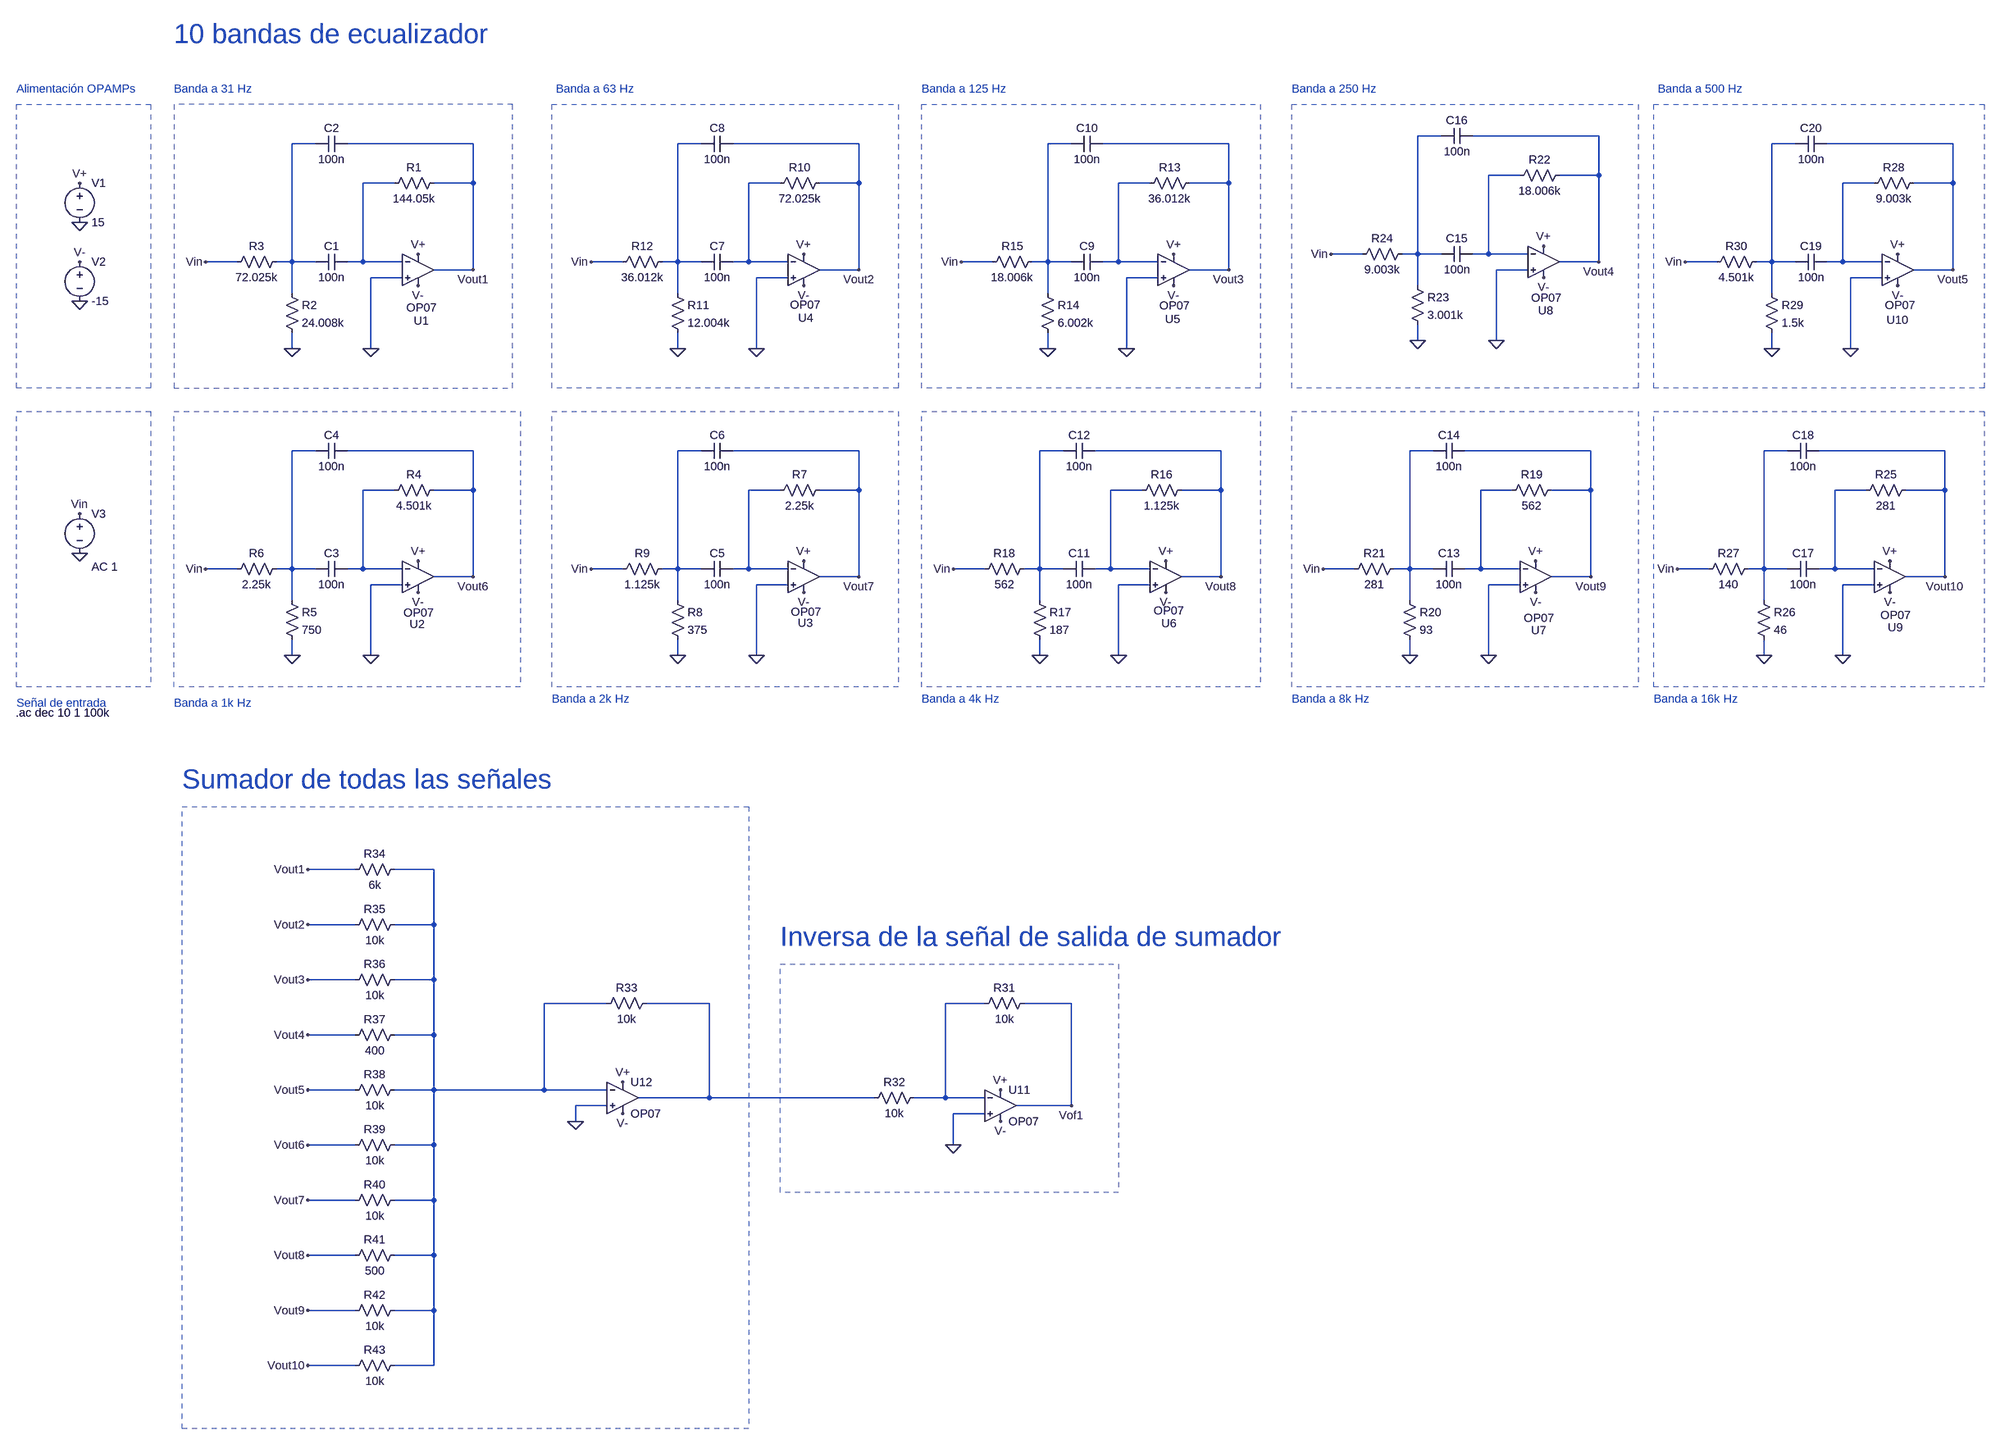
[diagram p0: schematic Ecualizador de 10 bandas.asc]
Ecualizador de 10 bandas.asc, the LTspice schematic file:
Version 4
SHEET 1 3644 2564
WIRE 2448 -112 2400 -112
WIRE 2768 -112 2512 -112
WIRE 160 -96 112 -96
WIRE 480 -96 224 -96
WIRE 944 -96 896 -96
WIRE 1264 -96 1008 -96
WIRE 1696 -96 1648 -96
WIRE 2016 -96 1760 -96
WIRE 3168 -96 3120 -96
WIRE 3488 -96 3232 -96
WIRE 2608 -32 2544 -32
WIRE 2768 -32 2768 -112
WIRE 2768 -32 2688 -32
WIRE 320 -16 256 -16
WIRE 480 -16 480 -96
WIRE 480 -16 400 -16
WIRE 1104 -16 1040 -16
WIRE 1264 -16 1264 -96
WIRE 1264 -16 1184 -16
WIRE 1856 -16 1792 -16
WIRE 2016 -16 2016 -96
WIRE 2016 -16 1936 -16
WIRE 3328 -16 3264 -16
WIRE 3488 -16 3488 -96
WIRE 3488 -16 3408 -16
WIRE 2288 128 2224 128
WIRE 2400 128 2400 -112
WIRE 2400 128 2368 128
WIRE 2448 128 2400 128
WIRE 2544 128 2544 -32
WIRE 2544 128 2512 128
WIRE 2624 128 2544 128
WIRE 0 144 -64 144
WIRE 112 144 112 -96
WIRE 112 144 80 144
WIRE 160 144 112 144
WIRE 256 144 256 -16
WIRE 256 144 224 144
WIRE 336 144 256 144
WIRE 784 144 720 144
WIRE 896 144 896 -96
WIRE 896 144 864 144
WIRE 944 144 896 144
WIRE 1040 144 1040 -16
WIRE 1040 144 1008 144
WIRE 1120 144 1040 144
WIRE 1536 144 1472 144
WIRE 1648 144 1648 -96
WIRE 1648 144 1616 144
WIRE 1696 144 1648 144
WIRE 1792 144 1792 -16
WIRE 1792 144 1760 144
WIRE 1872 144 1792 144
WIRE 2768 144 2768 -32
WIRE 2768 144 2688 144
WIRE 3008 144 2944 144
WIRE 3120 144 3120 -96
WIRE 3120 144 3088 144
WIRE 3168 144 3120 144
WIRE 3264 144 3264 -16
WIRE 3264 144 3232 144
WIRE 3344 144 3264 144
WIRE 480 160 480 -16
WIRE 480 160 400 160
WIRE 1264 160 1264 -16
WIRE 1264 160 1184 160
WIRE 2016 160 2016 -16
WIRE 2016 160 1936 160
WIRE 2624 160 2560 160
WIRE 3488 160 3488 -16
WIRE 3488 160 3408 160
WIRE 336 176 272 176
WIRE 1120 176 1056 176
WIRE 1872 176 1808 176
WIRE 3344 176 3280 176
WIRE 2400 192 2400 128
WIRE 112 208 112 144
WIRE 896 208 896 144
WIRE 1648 208 1648 144
WIRE 3120 208 3120 144
WIRE 2400 304 2400 272
WIRE 2560 304 2560 160
WIRE 112 320 112 288
WIRE 272 320 272 176
WIRE 896 320 896 288
WIRE 1056 320 1056 176
WIRE 1648 320 1648 288
WIRE 1808 320 1808 176
WIRE 3120 320 3120 288
WIRE 3280 320 3280 176
WIRE 160 528 112 528
WIRE 480 528 224 528
WIRE 944 528 896 528
WIRE 1264 528 1008 528
WIRE 1680 528 1632 528
WIRE 2000 528 1744 528
WIRE 2432 528 2384 528
WIRE 2752 528 2496 528
WIRE 3152 528 3104 528
WIRE 3472 528 3216 528
WIRE 320 608 256 608
WIRE 480 608 480 528
WIRE 480 608 400 608
WIRE 1104 608 1040 608
WIRE 1264 608 1264 528
WIRE 1264 608 1184 608
WIRE 1840 608 1776 608
WIRE 2000 608 2000 528
WIRE 2000 608 1920 608
WIRE 2592 608 2528 608
WIRE 2752 608 2752 528
WIRE 2752 608 2672 608
WIRE 3312 608 3248 608
WIRE 3472 608 3472 528
WIRE 3472 608 3392 608
WIRE 0 768 -64 768
WIRE 112 768 112 528
WIRE 112 768 80 768
WIRE 160 768 112 768
WIRE 256 768 256 608
WIRE 256 768 224 768
WIRE 336 768 256 768
WIRE 784 768 720 768
WIRE 896 768 896 528
WIRE 896 768 864 768
WIRE 944 768 896 768
WIRE 1040 768 1040 608
WIRE 1040 768 1008 768
WIRE 1120 768 1040 768
WIRE 1520 768 1456 768
WIRE 1632 768 1632 528
WIRE 1632 768 1600 768
WIRE 1680 768 1632 768
WIRE 1776 768 1776 608
WIRE 1776 768 1744 768
WIRE 1856 768 1776 768
WIRE 2272 768 2208 768
WIRE 2384 768 2384 528
WIRE 2384 768 2352 768
WIRE 2432 768 2384 768
WIRE 2528 768 2528 608
WIRE 2528 768 2496 768
WIRE 2608 768 2528 768
WIRE 2992 768 2928 768
WIRE 3104 768 3104 528
WIRE 3104 768 3072 768
WIRE 3152 768 3104 768
WIRE 3248 768 3248 608
WIRE 3248 768 3216 768
WIRE 3328 768 3248 768
WIRE 480 784 480 608
WIRE 480 784 400 784
WIRE 1264 784 1264 608
WIRE 1264 784 1184 784
WIRE 2000 784 2000 608
WIRE 2000 784 1920 784
WIRE 2752 784 2752 608
WIRE 2752 784 2672 784
WIRE 3472 784 3472 608
WIRE 3472 784 3392 784
WIRE 336 800 272 800
WIRE 1120 800 1056 800
WIRE 1856 800 1792 800
WIRE 2608 800 2544 800
WIRE 3328 800 3264 800
WIRE 112 832 112 768
WIRE 896 832 896 768
WIRE 1632 832 1632 768
WIRE 2384 832 2384 768
WIRE 3104 832 3104 768
WIRE 112 944 112 912
WIRE 272 944 272 800
WIRE 896 944 896 912
WIRE 1056 944 1056 800
WIRE 1632 944 1632 912
WIRE 1792 944 1792 800
WIRE 2384 944 2384 912
WIRE 2544 944 2544 800
WIRE 3104 944 3104 912
WIRE 3264 944 3264 800
WIRE 240 1424 144 1424
WIRE 400 1424 320 1424
WIRE 240 1536 144 1536
WIRE 400 1536 400 1424
WIRE 400 1536 320 1536
WIRE 240 1648 144 1648
WIRE 400 1648 400 1536
WIRE 400 1648 320 1648
WIRE 752 1696 624 1696
WIRE 960 1696 832 1696
WIRE 1520 1696 1440 1696
WIRE 1696 1696 1600 1696
WIRE 240 1760 144 1760
WIRE 400 1760 400 1648
WIRE 400 1760 320 1760
WIRE 240 1872 144 1872
WIRE 400 1872 400 1760
WIRE 400 1872 320 1872
WIRE 624 1872 624 1696
WIRE 624 1872 400 1872
WIRE 752 1872 624 1872
WIRE 960 1888 960 1696
WIRE 960 1888 816 1888
WIRE 1296 1888 960 1888
WIRE 1440 1888 1440 1696
WIRE 1440 1888 1376 1888
WIRE 1520 1888 1440 1888
WIRE 752 1904 688 1904
WIRE 1696 1904 1696 1696
WIRE 1696 1904 1584 1904
WIRE 1520 1920 1456 1920
WIRE 688 1936 688 1904
WIRE 240 1984 144 1984
WIRE 400 1984 400 1872
WIRE 400 1984 320 1984
WIRE 1456 1984 1456 1920
WIRE 240 2096 144 2096
WIRE 400 2096 400 1984
WIRE 400 2096 320 2096
WIRE 240 2208 144 2208
WIRE 400 2208 400 2096
WIRE 400 2208 320 2208
WIRE 240 2320 144 2320
WIRE 400 2320 400 2208
WIRE 400 2320 320 2320
WIRE 240 2432 144 2432
WIRE 400 2432 400 2320
WIRE 400 2432 320 2432
FLAG -320 224 0
FLAG -320 64 0
FLAG -320 -16 V+
FLAG -320 144 V-
FLAG 368 128 V+
FLAG 368 192 V-
FLAG 112 320 0
FLAG 272 320 0
FLAG 368 752 V+
FLAG 368 816 V-
FLAG 112 944 0
FLAG 272 944 0
FLAG 1152 752 V+
FLAG 1152 816 V-
FLAG 896 944 0
FLAG 1056 944 0
FLAG 1152 128 V+
FLAG 1152 192 V-
FLAG 896 320 0
FLAG 1056 320 0
FLAG 1904 128 V+
FLAG 1904 192 V-
FLAG 1648 320 0
FLAG 1808 320 0
FLAG 1888 752 V+
FLAG 1888 816 V-
FLAG 1632 944 0
FLAG 1792 944 0
FLAG 2640 752 V+
FLAG 2640 816 V-
FLAG 2384 944 0
FLAG 2544 944 0
FLAG 2656 112 V+
FLAG 2656 176 V-
FLAG 2400 304 0
FLAG 2560 304 0
FLAG 3360 752 V+
FLAG 3360 816 V-
FLAG 3104 944 0
FLAG 3264 944 0
FLAG 3376 128 V+
FLAG 3376 192 V-
FLAG 3120 320 0
FLAG 3280 320 0
FLAG -320 656 Vin
FLAG -320 736 0
FLAG -64 144 Vin
FLAG 720 144 Vin
FLAG 1472 144 Vin
FLAG 2224 128 Vin
FLAG 2944 144 Vin
FLAG -64 768 Vin
FLAG 720 768 Vin
FLAG 1456 768 Vin
FLAG 2208 768 Vin
FLAG 2928 768 Vin
FLAG 480 160 Vout1
FLAG 1264 160 Vout2
FLAG 2016 160 Vout3
FLAG 2768 144 Vout4
FLAG 3488 160 Vout5
FLAG 3472 784 Vout10
FLAG 2752 784 Vout9
FLAG 2000 784 Vout8
FLAG 1264 784 Vout7
FLAG 480 784 Vout6
FLAG 1456 1984 0
FLAG 1552 1872 V+
FLAG 1552 1936 V-
FLAG 1696 1904 Vof1
FLAG 784 1856 V+
FLAG 784 1920 V-
FLAG 688 1936 0
FLAG 144 1424 Vout1
FLAG 144 1536 Vout2
FLAG 144 1648 Vout3
FLAG 144 1760 Vout4
FLAG 144 1872 Vout5
FLAG 144 1984 Vout6
FLAG 144 2096 Vout7
FLAG 144 2208 Vout8
FLAG 144 2320 Vout9
FLAG 144 2432 Vout10
SYMBOL OpAmps\\OP07 368 96 R0
WINDOW 0 -9 168 Left 2
WINDOW 3 -24 141 Left 2
SYMATTR InstName U1
SYMBOL voltage -320 -32 R0
WINDOW 123 0 0 Left 0
WINDOW 39 0 0 Left 0
SYMATTR InstName V1
SYMATTR Value 15
SYMBOL voltage -320 128 R0
WINDOW 123 0 0 Left 0
WINDOW 39 0 0 Left 0
SYMATTR InstName V2
SYMATTR Value -15
SYMBOL res 416 -32 R90
WINDOW 0 0 56 VBottom 2
WINDOW 3 32 56 VTop 2
SYMATTR InstName R1
SYMATTR Value 144.05k
SYMBOL res 96 192 R0
SYMATTR InstName R2
SYMATTR Value 24.008k
SYMBOL res 96 128 R90
WINDOW 0 0 56 VBottom 2
WINDOW 3 32 56 VTop 2
SYMATTR InstName R3
SYMATTR Value 72.025k
SYMBOL cap 224 128 R90
WINDOW 0 0 32 VBottom 2
WINDOW 3 32 32 VTop 2
SYMATTR InstName C1
SYMATTR Value 100n
SYMBOL cap 224 -112 R90
WINDOW 0 0 32 VBottom 2
WINDOW 3 32 32 VTop 2
SYMATTR InstName C2
SYMATTR Value 100n
SYMBOL OpAmps\\OP07 368 720 R0
WINDOW 0 -17 160 Left 2
WINDOW 3 -30 137 Left 2
SYMATTR InstName U2
SYMBOL res 416 592 R90
WINDOW 0 0 56 VBottom 2
WINDOW 3 32 56 VTop 2
SYMATTR InstName R4
SYMATTR Value 4.501k
SYMBOL res 96 816 R0
SYMATTR InstName R5
SYMATTR Value 750
SYMBOL res 96 752 R90
WINDOW 0 0 56 VBottom 2
WINDOW 3 32 56 VTop 2
SYMATTR InstName R6
SYMATTR Value 2.25k
SYMBOL cap 224 752 R90
WINDOW 0 0 32 VBottom 2
WINDOW 3 32 32 VTop 2
SYMATTR InstName C3
SYMATTR Value 100n
SYMBOL cap 224 512 R90
WINDOW 0 0 32 VBottom 2
WINDOW 3 32 32 VTop 2
SYMATTR InstName C4
SYMATTR Value 100n
SYMBOL OpAmps\\OP07 1152 720 R0
WINDOW 0 -12 158 Left 2
WINDOW 3 -26 135 Left 2
SYMATTR InstName U3
SYMBOL res 1200 592 R90
WINDOW 0 0 56 VBottom 2
WINDOW 3 32 56 VTop 2
SYMATTR InstName R7
SYMATTR Value 2.25k
SYMBOL res 880 816 R0
SYMATTR InstName R8
SYMATTR Value 375
SYMBOL res 880 752 R90
WINDOW 0 0 56 VBottom 2
WINDOW 3 32 56 VTop 2
SYMATTR InstName R9
SYMATTR Value 1.125k
SYMBOL cap 1008 752 R90
WINDOW 0 0 32 VBottom 2
WINDOW 3 32 32 VTop 2
SYMATTR InstName C5
SYMATTR Value 100n
SYMBOL cap 1008 512 R90
WINDOW 0 0 32 VBottom 2
WINDOW 3 32 32 VTop 2
SYMATTR InstName C6
SYMATTR Value 100n
SYMBOL OpAmps\\OP07 1152 96 R0
WINDOW 0 -11 162 Left 2
WINDOW 3 -28 135 Left 2
SYMATTR InstName U4
SYMBOL res 1200 -32 R90
WINDOW 0 0 56 VBottom 2
WINDOW 3 32 56 VTop 2
SYMATTR InstName R10
SYMATTR Value 72.025k
SYMBOL res 880 192 R0
SYMATTR InstName R11
SYMATTR Value 12.004k
SYMBOL res 880 128 R90
WINDOW 0 0 56 VBottom 2
WINDOW 3 32 56 VTop 2
SYMATTR InstName R12
SYMATTR Value 36.012k
SYMBOL cap 1008 128 R90
WINDOW 0 0 32 VBottom 2
WINDOW 3 32 32 VTop 2
SYMATTR InstName C7
SYMATTR Value 100n
SYMBOL cap 1008 -112 R90
WINDOW 0 0 32 VBottom 2
WINDOW 3 32 32 VTop 2
SYMATTR InstName C8
SYMATTR Value 100n
SYMBOL OpAmps\\OP07 1904 96 R0
WINDOW 0 -17 164 Left 2
WINDOW 3 -29 137 Left 2
SYMATTR InstName U5
SYMBOL res 1952 -32 R90
WINDOW 0 0 56 VBottom 2
WINDOW 3 32 56 VTop 2
SYMATTR InstName R13
SYMATTR Value 36.012k
SYMBOL res 1632 192 R0
SYMATTR InstName R14
SYMATTR Value 6.002k
SYMBOL res 1632 128 R90
WINDOW 0 0 56 VBottom 2
WINDOW 3 32 56 VTop 2
SYMATTR InstName R15
SYMATTR Value 18.006k
SYMBOL cap 1760 128 R90
WINDOW 0 0 32 VBottom 2
WINDOW 3 32 32 VTop 2
SYMATTR InstName C9
SYMATTR Value 100n
SYMBOL cap 1760 -112 R90
WINDOW 0 0 32 VBottom 2
WINDOW 3 32 32 VTop 2
SYMATTR InstName C10
SYMATTR Value 100n
SYMBOL OpAmps\\OP07 1888 720 R0
WINDOW 0 -9 159 Left 2
WINDOW 3 -25 133 Left 2
SYMATTR InstName U6
SYMBOL res 1936 592 R90
WINDOW 0 0 56 VBottom 2
WINDOW 3 32 56 VTop 2
SYMATTR InstName R16
SYMATTR Value 1.125k
SYMBOL res 1616 816 R0
SYMATTR InstName R17
SYMATTR Value 187
SYMBOL res 1616 752 R90
WINDOW 0 0 56 VBottom 2
WINDOW 3 32 56 VTop 2
SYMATTR InstName R18
SYMATTR Value 562
SYMBOL cap 1744 752 R90
WINDOW 0 0 32 VBottom 2
WINDOW 3 32 32 VTop 2
SYMATTR InstName C11
SYMATTR Value 100n
SYMBOL cap 1744 512 R90
WINDOW 0 0 32 VBottom 2
WINDOW 3 32 32 VTop 2
SYMATTR InstName C12
SYMATTR Value 100n
SYMBOL OpAmps\\OP07 2640 720 R0
WINDOW 0 -9 173 Left 2
WINDOW 3 -24 148 Left 2
SYMATTR InstName U7
SYMBOL res 2688 592 R90
WINDOW 0 0 56 VBottom 2
WINDOW 3 32 56 VTop 2
SYMATTR InstName R19
SYMATTR Value 562
SYMBOL res 2368 816 R0
SYMATTR InstName R20
SYMATTR Value 93
SYMBOL res 2368 752 R90
WINDOW 0 0 56 VBottom 2
WINDOW 3 32 56 VTop 2
SYMATTR InstName R21
SYMATTR Value 281
SYMBOL cap 2496 752 R90
WINDOW 0 0 32 VBottom 2
WINDOW 3 32 32 VTop 2
SYMATTR InstName C13
SYMATTR Value 100n
SYMBOL cap 2496 512 R90
WINDOW 0 0 32 VBottom 2
WINDOW 3 32 32 VTop 2
SYMATTR InstName C14
SYMATTR Value 100n
SYMBOL OpAmps\\OP07 2656 80 R0
WINDOW 0 -11 163 Left 2
WINDOW 3 -25 137 Left 2
SYMATTR InstName U8
SYMBOL res 2704 -48 R90
WINDOW 0 0 56 VBottom 2
WINDOW 3 32 56 VTop 2
SYMATTR InstName R22
SYMATTR Value 18.006k
SYMBOL res 2384 176 R0
SYMATTR InstName R23
SYMATTR Value 3.001k
SYMBOL res 2384 112 R90
WINDOW 0 0 56 VBottom 2
WINDOW 3 32 56 VTop 2
SYMATTR InstName R24
SYMATTR Value 9.003k
SYMBOL cap 2512 112 R90
WINDOW 0 0 32 VBottom 2
WINDOW 3 32 32 VTop 2
SYMATTR InstName C15
SYMATTR Value 100n
SYMBOL cap 2512 -128 R90
WINDOW 0 0 32 VBottom 2
WINDOW 3 32 32 VTop 2
SYMATTR InstName C16
SYMATTR Value 100n
SYMBOL OpAmps\\OP07 3360 720 R0
WINDOW 0 -4 167 Left 2
WINDOW 3 -19 142 Left 2
SYMATTR InstName U9
SYMBOL res 3408 592 R90
WINDOW 0 0 56 VBottom 2
WINDOW 3 32 56 VTop 2
SYMATTR InstName R25
SYMATTR Value 281
SYMBOL res 3088 816 R0
SYMATTR InstName R26
SYMATTR Value 46
SYMBOL res 3088 752 R90
WINDOW 0 0 56 VBottom 2
WINDOW 3 32 56 VTop 2
SYMATTR InstName R27
SYMATTR Value 140
SYMBOL cap 3216 752 R90
WINDOW 0 0 32 VBottom 2
WINDOW 3 32 32 VTop 2
SYMATTR InstName C17
SYMATTR Value 100n
SYMBOL cap 3216 512 R90
WINDOW 0 0 32 VBottom 2
WINDOW 3 32 32 VTop 2
SYMATTR InstName C18
SYMATTR Value 100n
SYMBOL OpAmps\\OP07 3376 96 R0
WINDOW 0 -23 166 Left 2
WINDOW 3 -26 136 Left 2
SYMATTR InstName U10
SYMBOL res 3424 -32 R90
WINDOW 0 0 56 VBottom 2
WINDOW 3 32 56 VTop 2
SYMATTR InstName R28
SYMATTR Value 9.003k
SYMBOL res 3104 192 R0
SYMATTR InstName R29
SYMATTR Value 1.5k
SYMBOL res 3104 128 R90
WINDOW 0 0 56 VBottom 2
WINDOW 3 32 56 VTop 2
SYMATTR InstName R30
SYMATTR Value 4.501k
SYMBOL cap 3232 128 R90
WINDOW 0 0 32 VBottom 2
WINDOW 3 32 32 VTop 2
SYMATTR InstName C19
SYMATTR Value 100n
SYMBOL cap 3232 -112 R90
WINDOW 0 0 32 VBottom 2
WINDOW 3 32 32 VTop 2
SYMATTR InstName C20
SYMATTR Value 100n
SYMBOL voltage -320 640 R0
WINDOW 123 24 124 Left 2
WINDOW 39 0 0 Left 0
SYMATTR InstName V3
SYMATTR Value ""
SYMATTR Value2 AC 1
SYMBOL OpAmps\\OP07 1552 1840 R0
SYMATTR InstName U11
SYMBOL res 1616 1680 R90
WINDOW 0 0 56 VBottom 2
WINDOW 3 32 56 VTop 2
SYMATTR InstName R31
SYMATTR Value 10k
SYMBOL res 1392 1872 R90
WINDOW 0 0 56 VBottom 2
WINDOW 3 32 56 VTop 2
SYMATTR InstName R32
SYMATTR Value 10k
SYMBOL OpAmps\\OP07 784 1824 R0
SYMATTR InstName U12
SYMBOL res 848 1680 R90
WINDOW 0 0 56 VBottom 2
WINDOW 3 32 56 VTop 2
SYMATTR InstName R33
SYMATTR Value 10k
SYMBOL res 336 1408 R90
WINDOW 0 0 56 VBottom 2
WINDOW 3 32 56 VTop 2
SYMATTR InstName R34
SYMATTR Value 6k
SYMBOL res 336 1520 R90
WINDOW 0 0 56 VBottom 2
WINDOW 3 32 56 VTop 2
SYMATTR InstName R35
SYMATTR Value 10k
SYMBOL res 336 1632 R90
WINDOW 0 0 56 VBottom 2
WINDOW 3 32 56 VTop 2
SYMATTR InstName R36
SYMATTR Value 10k
SYMBOL res 336 1744 R90
WINDOW 0 0 56 VBottom 2
WINDOW 3 32 56 VTop 2
SYMATTR InstName R37
SYMATTR Value 400
SYMBOL res 336 1856 R90
WINDOW 0 0 56 VBottom 2
WINDOW 3 32 56 VTop 2
SYMATTR InstName R38
SYMATTR Value 10k
SYMBOL res 336 1968 R90
WINDOW 0 0 56 VBottom 2
WINDOW 3 32 56 VTop 2
SYMATTR InstName R39
SYMATTR Value 10k
SYMBOL res 336 2080 R90
WINDOW 0 0 56 VBottom 2
WINDOW 3 32 56 VTop 2
SYMATTR InstName R40
SYMATTR Value 10k
SYMBOL res 336 2192 R90
WINDOW 0 0 56 VBottom 2
WINDOW 3 32 56 VTop 2
SYMATTR InstName R41
SYMATTR Value 500
SYMBOL res 336 2304 R90
WINDOW 0 0 56 VBottom 2
WINDOW 3 32 56 VTop 2
SYMATTR InstName R42
SYMATTR Value 10k
SYMBOL res 336 2416 R90
WINDOW 0 0 56 VBottom 2
WINDOW 3 32 56 VTop 2
SYMATTR InstName R43
SYMATTR Value 10k
TEXT -128 -208 Left 2 ;Banda a 31 Hz
TEXT 648 -208 Left 2 ;Banda a 63 Hz
TEXT 1392 -208 Left 2 ;Banda a 125 Hz
TEXT 2144 -208 Left 2 ;Banda a 250 Hz
TEXT 2888 -208 Left 2 ;Banda a 500 Hz
TEXT -128 1040 Left 2 ;Banda a 1k Hz
TEXT 640 1032 Left 2 ;Banda a 2k Hz
TEXT 1392 1032 Left 2 ;Banda a 4k Hz
TEXT 2144 1032 Left 2 ;Banda a 8k Hz
TEXT 2880 1032 Left 2 ;Banda a 16k Hz
TEXT -448 -208 Left 2 ;Alimentación OPAMPs
TEXT -448 1040 Left 2 ;Señal de entrada
TEXT -450 1060 Left 2 !.ac dec 10 1 100k
TEXT -128 -320 Left 5 ;10 bandas de ecualizador
TEXT 1104 1560 Left 5 ;Inversa de la señal de salida de sumador
TEXT -112 1240 Left 5 ;Sumador de todas las señales
LINE Normal 560 -176 -128 -176 2
LINE Normal 560 400 560 -176 2
LINE Normal -128 400 560 400 2
LINE Normal -128 -176 -128 400 2
RECTANGLE Normal 1344 400 640 -176 2
RECTANGLE Normal 2080 400 1392 -176 2
RECTANGLE Normal 2848 400 2144 -176 2
RECTANGLE Normal 3552 400 2880 -176 2
RECTANGLE Normal 576 1008 -128 448 2
RECTANGLE Normal 1344 1008 640 448 2
RECTANGLE Normal 2080 1008 1392 448 2
RECTANGLE Normal 2848 1008 2144 448 2
RECTANGLE Normal 3552 1008 2880 448 2
RECTANGLE Normal -176 400 -448 -176 2
RECTANGLE Normal -176 1008 -448 448 2
RECTANGLE Normal 1792 2080 1104 1616 2
RECTANGLE Normal 1040 2560 -112 1296 2

The netlist it stands for:
* Ecualizador de 10 bandas.asc
XU1 0 N007 V+ V- Vout1 LT1001  ; OP07, pins In+ In- V+ V- OUT
V1 V+ 0 15
V2 V- 0 -15
R1 Vout1 N007 144.05k
R2 N002 0 24.008k
R3 N002 Vin 72.025k
C1 N007 N002 100n
C2 Vout1 N002 100n
XU2 0 N016 V+ V- Vout6 LT1001  ; OP07, pins In+ In- V+ V- OUT
R4 Vout6 N016 4.501k
R5 N011 0 750
R6 N011 Vin 2.25k
C3 N016 N011 100n
C4 Vout6 N011 100n
XU3 0 N017 V+ V- Vout7 LT1001  ; OP07, pins In+ In- V+ V- OUT
R7 Vout7 N017 2.25k
R8 N012 0 375
R9 N012 Vin 1.125k
C5 N017 N012 100n
C6 Vout7 N012 100n
XU4 0 N008 V+ V- Vout2 LT1001  ; OP07, pins In+ In- V+ V- OUT
R10 Vout2 N008 72.025k
R11 N003 0 12.004k
R12 N003 Vin 36.012k
C7 N008 N003 100n
C8 Vout2 N003 100n
XU5 0 N009 V+ V- Vout3 LT1001  ; OP07, pins In+ In- V+ V- OUT
R13 Vout3 N009 36.012k
R14 N004 0 6.002k
R15 N004 Vin 18.006k
C9 N009 N004 100n
C10 Vout3 N004 100n
XU6 0 N018 V+ V- Vout8 LT1001  ; OP07, pins In+ In- V+ V- OUT
R16 Vout8 N018 1.125k
R17 N013 0 187
R18 N013 Vin 562
C11 N018 N013 100n
C12 Vout8 N013 100n
XU7 0 N019 V+ V- Vout9 LT1001  ; OP07, pins In+ In- V+ V- OUT
R19 Vout9 N019 562
R20 N014 0 93
R21 N014 Vin 281
C13 N019 N014 100n
C14 Vout9 N014 100n
XU8 0 N006 V+ V- Vout4 LT1001  ; OP07, pins In+ In- V+ V- OUT
R22 Vout4 N006 18.006k
R23 N001 0 3.001k
R24 N001 Vin 9.003k
C15 N006 N001 100n
C16 Vout4 N001 100n
XU9 0 N020 V+ V- Vout10 LT1001  ; OP07, pins In+ In- V+ V- OUT
R25 Vout10 N020 281
R26 N015 0 46
R27 N015 Vin 140
C17 N020 N015 100n
C18 Vout10 N015 100n
XU10 0 N010 V+ V- Vout5 LT1001  ; OP07, pins In+ In- V+ V- OUT
R28 Vout5 N010 9.003k
R29 N005 0 1.5k
R30 N005 Vin 4.501k
C19 N010 N005 100n
C20 Vout5 N005 100n
V3 Vin 0 AC 1
XU11 0 N023 V+ V- Vof1 LT1001  ; OP07, pins In+ In- V+ V- OUT
R31 Vof1 N023 10k
R32 N023 N022 10k
XU12 0 N021 V+ V- N022 LT1001  ; OP07, pins In+ In- V+ V- OUT
R33 N022 N021 10k
R34 N021 Vout1 6k
R35 N021 Vout2 10k
R36 N021 Vout3 10k
R37 N021 Vout4 400
R38 N021 Vout5 10k
R39 N021 Vout6 10k
R40 N021 Vout7 10k
R41 N021 Vout8 500
R42 N021 Vout9 10k
R43 N021 Vout10 10k
* Banda a 31 Hz
* Banda a 63 Hz
* Banda a 125 Hz
* Banda a 250 Hz
* Banda a 500 Hz
* Banda a 1k Hz
* Banda a 2k Hz
* Banda a 4k Hz
* Banda a 8k Hz
* Banda a 16k Hz
* Alimentación OPAMPs
* Señal de entrada
.ac dec 10 1 100k
* 10 bandas de ecualizador
* Inversa de la señal de salida de sumador
* Sumador de todas las señales
.lib LTC.lib
.backanno
.end

* Results of the author's LTspice run, read from the files saved beside the schematic
* Operating Point, zero values left out:
*   V(v+) = 15 V
*   V(v-) = -15 V
*   I(V2) = 27 mA
*   I(V1) = -27 mA
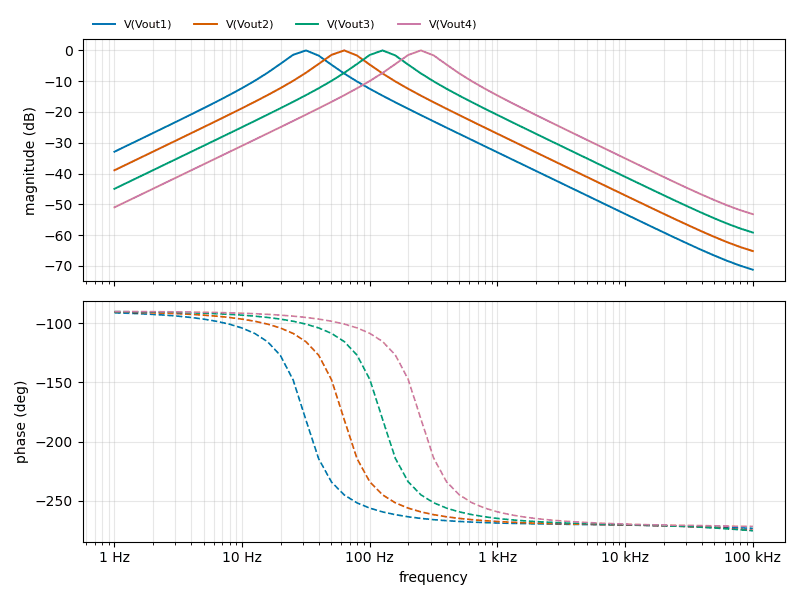
[diagram p1: AC Analysis of Ecualizador de 10 bandas.asc, plotted from the saved traces]
* AC Analysis, 1 run:
*   V(Vout1): -32.90 dB at 1 Hz, -71.21 dB at 100 kHz, peak -0.00 dB at 31.62 Hz, 3 dB below the peak at 22.16 Hz and 44.11 Hz
*   V(Vout2): -38.93 dB at 1 Hz, -65.17 dB at 100 kHz, peak -0.00 dB at 63.1 Hz, 3 dB below the peak at 44.32 Hz and 88.19 Hz
*   V(Vout3): -44.95 dB at 1 Hz, -59.14 dB at 100 kHz, peak -0.00 dB at 125.9 Hz, 3 dB below the peak at 88.63 Hz and 176.3 Hz
*   V(Vout4): -50.97 dB at 1 Hz, -53.17 dB at 100 kHz, peak -0.00 dB at 251.2 Hz, 3 dB below the peak at 177.2 Hz and 352.5 Hz